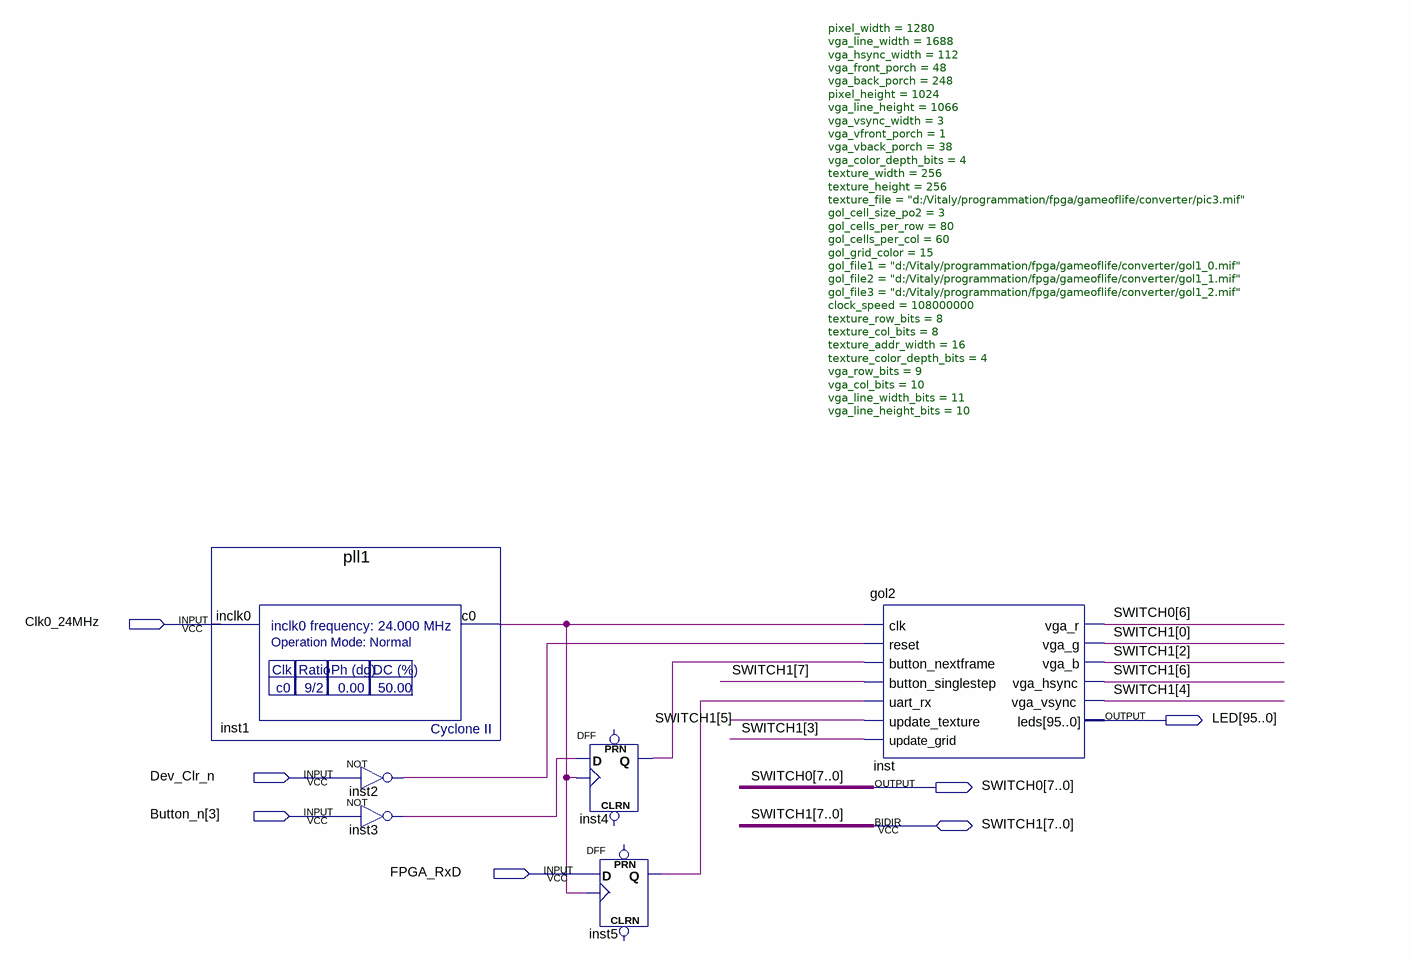
[diagram p0: schematic sheet]
// Quartus schematic gameoflife_bd.bdf as structural Verilog: 6 symbols, 7 pins
module gameoflife_bd (
  input  Clk0_24MHz,
  input  Dev_Clr_n,
  input  [3:3] Button_n,
  input  FPGA_RxD,
  inout  [7:0] SWITCH1,
  output [95:0] LED,
  output [7:0] SWITCH0
);

  wire inst1_c0, inst2_out, inst3_out, inst4_q, inst5_q;

  pll1 inst1 (.inclk0(Clk0_24MHz), .c0(inst1_c0));
  not inst2 (inst2_out, Dev_Clr_n);
  not inst3 (inst3_out, Button_n[3]);
  DFF inst4 (.CLK(inst1_c0), .D(inst3_out), .Q(inst4_q));  // open: CLRN, PRN
  DFF inst5 (.CLK(inst1_c0), .D(FPGA_RxD), .Q(inst5_q));  // open: CLRN, PRN
  gol2 #(.pixel_width(1280), .vga_line_width(1688), .vga_hsync_width(112), .vga_front_porch(48), .vga_back_porch(248), .pixel_height(1024), .vga_line_height(1066), .vga_vsync_width(3), .vga_vfront_porch(1), .vga_vback_porch(38), .vga_color_depth_bits(4), .texture_width(256), .texture_height(256), .texture_file("d:/Vitaly/programmation/fpga/gameoflife/converter/pic3.mif"), .gol_cell_size_po2(3), .gol_cells_per_row(80), .gol_cells_per_col(60), .gol_grid_color(15), .gol_file1("d:/Vitaly/programmation/fpga/gameoflife/converter/gol1_0.mif"), .gol_file2("d:/Vitaly/programmation/fpga/gameoflife/converter/gol1_1.mif"), .gol_file3("d:/Vitaly/programmation/fpga/gameoflife/converter/gol1_2.mif"), .clock_speed(108000000), .texture_row_bits(8), .texture_col_bits(8), .texture_addr_width(16), .texture_color_depth_bits(4), .vga_row_bits(9), .vga_col_bits(10), .vga_line_width_bits(11), .vga_line_height_bits(10)) inst (
    .clk(inst1_c0), .reset(inst2_out), .button_nextframe(inst4_q), .button_singlestep(SWITCH1[7]),
    .uart_rx(inst5_q), .update_texture(SWITCH1[5]), .update_grid(SWITCH1[3]), .vga_r(SWITCH0[6]),
    .vga_g(SWITCH1[0]), .vga_b(SWITCH1[2]), .vga_hsync(SWITCH1[6]), .vga_vsync(SWITCH1[4]), .leds(LED));
endmodule
